# EAGLE schematic SB (EAGLE 8.6.0)
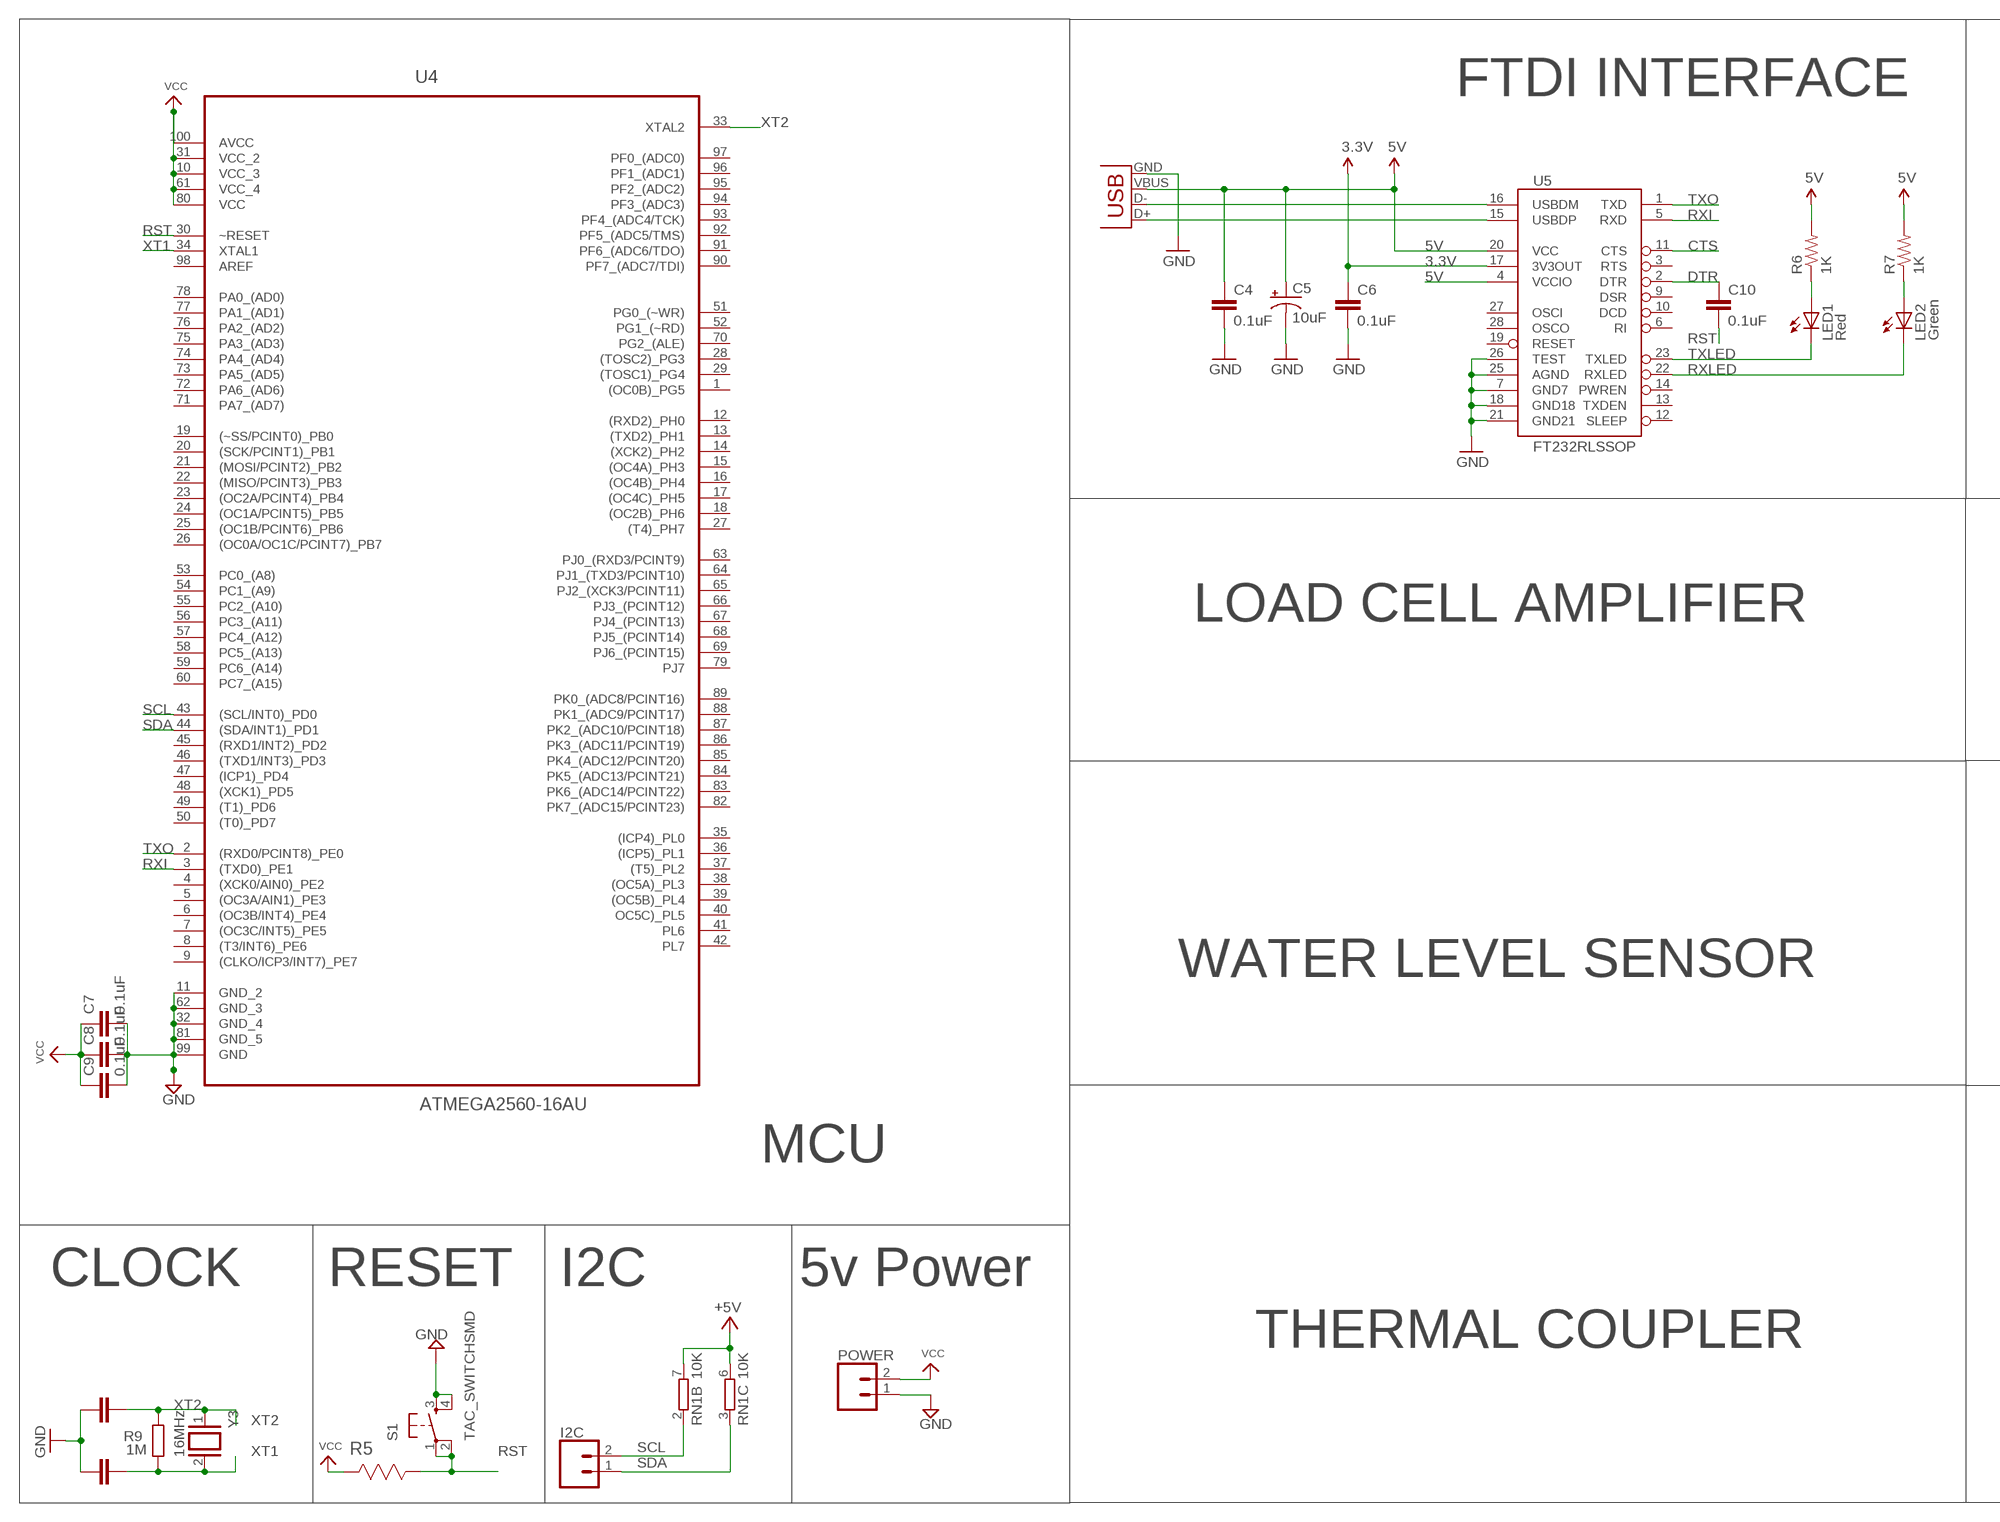
[diagram p0: schematic, sheet 1, part 1 of 2]
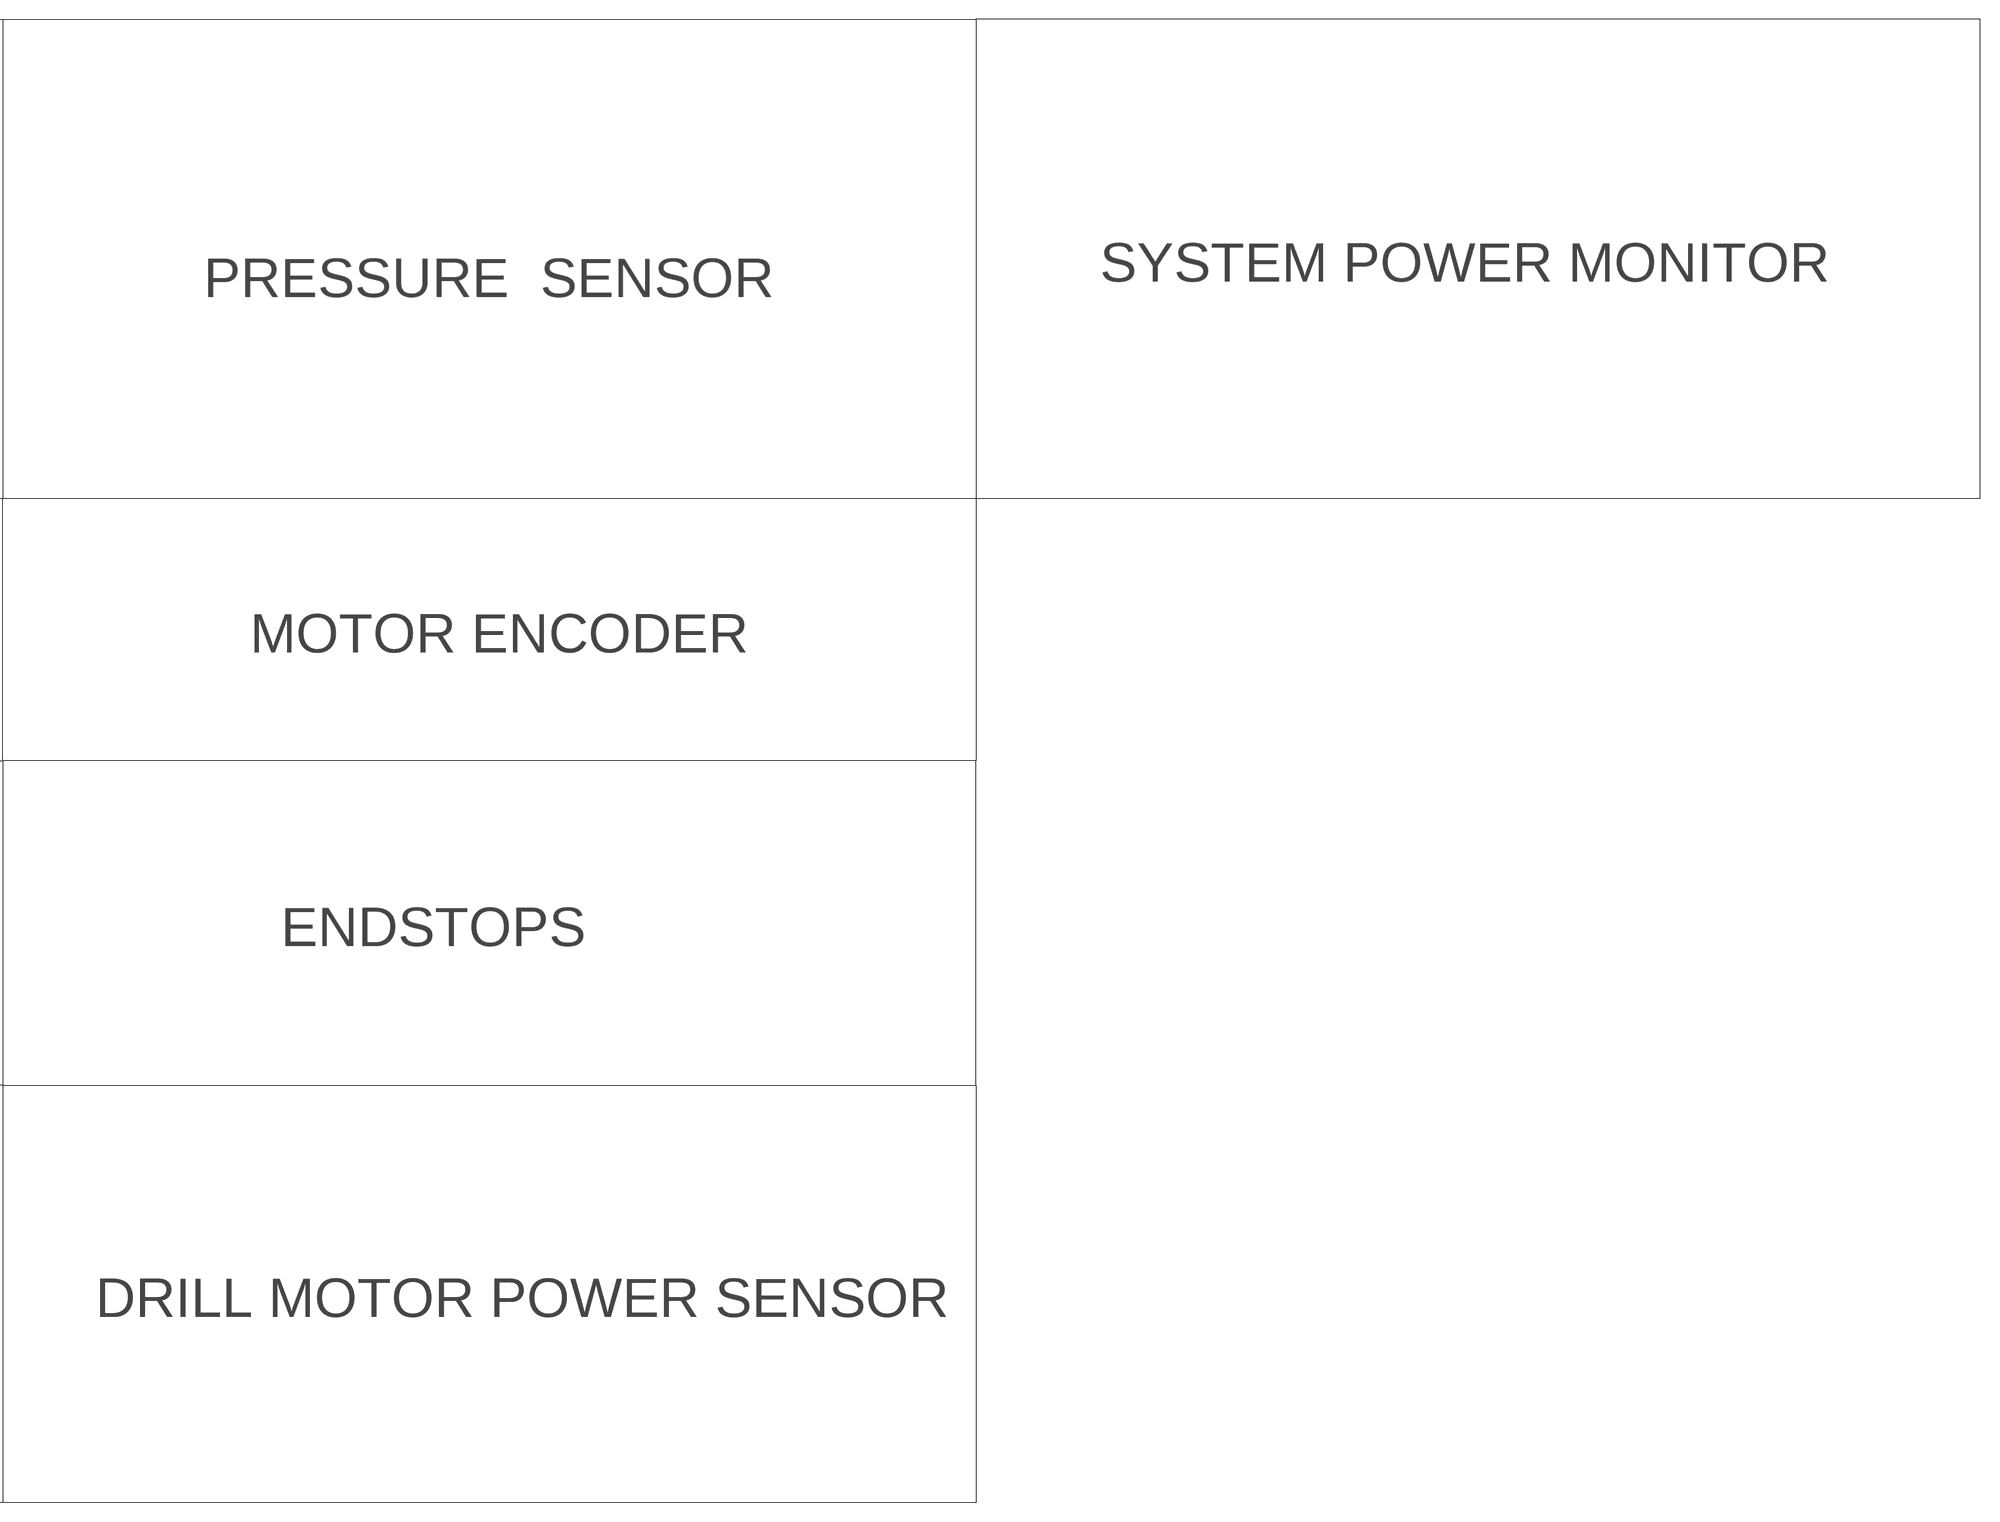
[diagram p1: schematic, sheet 1, part 2 of 2]

## Parts
C4  0.1uF  CAP0402-CAP  [0402-CAP]
C5  10uF  CAP_POL1206  [EIA3216]
C6  0.1uF  CAP0402-CAP  [0402-CAP]
C7  0.1uF  0.1UF-0603-25V-(+80/-20%)  [0603]
C8  0.1uF  0.1UF-0603-25V-(+80/-20%)  [0603]
C9  0.1uF  0.1UF-0603-25V-(+80/-20%)  [0603]
C10  0.1uF  0.1UF-0603-25V-(+80/-20%)  [0603]
C23  22p  C-EU0603-RND  [C0603-ROUND]
C24  22p  C-EU0603-RND  [C0603-ROUND]
I2C  CONN_023.5MM_LOCK  [SCREWTERMINAL-3.5MM-2_LOCK]
LED1  Red  LED0603  [LED-0603]
LED2  Green  LED0603  [LED-0603]
POWER  CONN_023.5MM_LOCK  [SCREWTERMINAL-3.5MM-2_LOCK]
R5  CRM0805-FW-R050ELF  [RESC2013X65N]
R6  1K  RESISTOR0402-RES  [0402-RES]
R7  1K  RESISTOR0402-RES  [0402-RES]
R9  1M  R-EU_R0603  [R0603-ROUND]
RN1  10K  4R-NCAT16  [CAT16]
S1  TAC_SWITCHSMD  [TACTILE-SWITCH-SMD]
U4  ATMEGA2560-16AU  [QFP50P1600X1600X120-100N]
U5  FT232RLSSOP  [SSOP28DB]
X2  USB-SMD-NS  [USB-MINIB-NOSTOP]
Y3  16MHz  XTAL/S  [QS]

## Nets
3.3V [power]: C6.1 U5.17(3V3OUT)
5V: C4.1 C5.A(+) R6.2 R7.2 U5.4(VCCIO) U5.20(VCC) X2.VBUS
CTS: U5.11(CTS)
DTR: C10.1 U5.2(DTR)
GND: C4.2 C5.C(-) C6.2 C7.2 C8.2 C9.2 C23.2 C24.2 POWER.1 S1.3 S1.4 U4.11(GND_2) U4.32(GND_4) U4.62(GND_3) U4.81(GND_5) U4.99(GND) U5.7(GND7) U5.18(GND18) U5.21(GND21) U5.25(AGND) U5.26(TEST) X2.GND
N$9: LED1.A R6.1
N$10: LED2.A R7.1
RST: C10.2 R5.1(R1) S1.1 S1.2 U4.30(~RESET)
RXI: U4.3((TXD0)_PE1) U5.5(RXD)
RXLED: LED2.C U5.22(RXLED)
SCL: I2C.2 RN1.2 U4.43((SCL/INT0)_PD0)
SDA: I2C.1 RN1.3 U4.44((SDA/INT1)_PD1)
TXLED: LED1.C U5.23(TXLED)
TXO: U4.2((RXD0/PCINT8)_PE0) U5.1(TXD)
USB_D+: U5.15(USBDP) X2.D+
USB_D-: U5.16(USBDM) X2.D-
VCC: C7.1 C8.1 C9.1 POWER.2 R5.2(R2) RN1.6 RN1.7 U4.10(VCC_3) U4.31(VCC_2) U4.61(VCC_4) U4.80(VCC) U4.100(AVCC) ; supply symbol labelled +5V
XT1: C23.1 R9.1 U4.34(XTAL1) Y3.2
XT2: C24.1 R9.2 U4.33(XTAL2) Y3.1
Unconnected: RN1.1 RN1.4 RN1.5 RN1.8 U4.1((OC0B)_PG5) U4.4((XCK0/AIN0)_PE2) U4.5((OC3A/AIN1)_PE3) U4.6((OC3B/INT4)_PE4) U4.7((OC3C/INT5)_PE5) U4.8((T3/INT6)_PE6) U4.9((CLKO/ICP3/INT7)_PE7) U4.12((RXD2)_PH0) U4.13((TXD2)_PH1) U4.14((XCK2)_PH2) U4.15((OC4A)_PH3) U4.16((OC4B)_PH4) U4.17((OC4C)_PH5) U4.18((OC2B)_PH6) U4.19((~SS/PCINT0)_PB0) U4.20((SCK/PCINT1)_PB1) U4.21((MOSI/PCINT2)_PB2) U4.22((MISO/PCINT3)_PB3) U4.23((OC2A/PCINT4)_PB4) U4.24((OC1A/PCINT5)_PB5) U4.25((OC1B/PCINT6)_PB6) U4.26((OC0A/OC1C/PCINT7)_PB7) U4.27((T4)_PH7) U4.28((TOSC2)_PG3) U4.29((TOSC1)_PG4) U4.35((ICP4)_PL0) U4.36((ICP5)_PL1) U4.37((T5)_PL2) U4.38((OC5A)_PL3) U4.39((OC5B)_PL4) U4.40(OC5C)_PL5) U4.41(PL6) U4.42(PL7) U4.45((RXD1/INT2)_PD2) U4.46((TXD1/INT3)_PD3) U4.47((ICP1)_PD4) U4.48((XCK1)_PD5) U4.49((T1)_PD6) U4.50((T0)_PD7) U4.51(PG0_(~WR)) U4.52(PG1_(~RD)) U4.53(PC0_(A8)) U4.54(PC1_(A9)) U4.55(PC2_(A10)) U4.56(PC3_(A11)) U4.57(PC4_(A12)) U4.58(PC5_(A13)) U4.59(PC6_(A14)) U4.60(PC7_(A15)) U4.63(PJ0_(RXD3/PCINT9)) U4.64(PJ1_(TXD3/PCINT10)) U4.65(PJ2_(XCK3/PCINT11)) U4.66(PJ3_(PCINT12)) U4.67(PJ4_(PCINT13)) U4.68(PJ5_(PCINT14)) U4.69(PJ6_(PCINT15)) U4.70(PG2_(ALE)) U4.71(PA7_(AD7)) U4.72(PA6_(AD6)) U4.73(PA5_(AD5)) U4.74(PA4_(AD4)) U4.75(PA3_(AD3)) U4.76(PA2_(AD2)) U4.77(PA1_(AD1)) U4.78(PA0_(AD0)) U4.79(PJ7) U4.82(PK7_(ADC15/PCINT23)) U4.83(PK6_(ADC14/PCINT22)) U4.84(PK5_(ADC13/PCINT21)) U4.85(PK4_(ADC12/PCINT20)) U4.86(PK3_(ADC11/PCINT19)) U4.87(PK2_(ADC10/PCINT18)) U4.88(PK1_(ADC9/PCINT17)) U4.89(PK0_(ADC8/PCINT16)) U4.90(PF7_(ADC7/TDI)) U4.91(PF6_(ADC6/TDO)) U4.92(PF5_(ADC5/TMS)) U4.93(PF4_(ADC4/TCK)) U4.94(PF3_(ADC3)) U4.95(PF2_(ADC2)) U4.96(PF1_(ADC1)) U4.97(PF0_(ADC0)) U4.98(AREF) U5.3(RTS) U5.6(RI) U5.9(DSR) U5.10(DCD) U5.12(SLEEP) U5.13(TXDEN) U5.14(PWREN) U5.19(RESET) U5.27(OSCI) U5.28(OSCO)

## Notes on the sheet
- FTDI INTERFACE
- PRESSURE  SENSOR | SYSTEM POWER MONITOR
- LOAD CELL AMPLIFIER
- MOTOR ENCODER
- ENDSTOPS
- WATER LEVEL SENSOR
- MCU
- CLOCK | RESET | I2C | 5v Power
- DRILL MOTOR POWER SENSOR
- THERMAL COUPLER

## Library data of the parts
C4 C6 = SparkFun:CAP: Capacitor Standard 0603 ceramic capacitor, and 0.1" leaded capacitor.
C5 = SparkFun:CAP_POL: Capacitor Polarized These are standard SMD and PTH capacitors. Normally 10uF, 47uF, and 100uF in electrolytic and tantalum varieties. Always verify the external diameter of the through hole cap, it varies with capacity, voltage, and manufacturer. The EIA devices should be standard.
C7-C10 = SparkFun-Capacitors:0.1UF: 0.1µF ceramic capacitors A capacitor is a passive two-terminal electrical component used to store electrical energy temporarily in an electric field.; PROD_ID: CAP-00810
C23 C24 = SmartPrj:C-EU: CAPACITOR, European symbol
I2C POWER = SparkFun-Retired:CONN_02: Multi connection point. Often used as Generic Header-pin footprint for 0.1 inch spaced/style header connections On any of the 0.1 inch spaced packages, you can populate with these: Break Away Headers - Straight <https://www.sparkfun.com/products/116> (PRT-00116) Break Away Male Headers - Right Angle <https://www.sparkfun.com/products/553> (PRT-00553) Female Headers <https://www.sparkfun.com/products/115> (PRT-00115) Break Away Headers - Machine Pin <https://www.sparkfun.com/products/117> (PRT-00117) Break Away Female Headers - Swiss Machine Pin <https://www.sparkfun.com/products/743> (PRT-00743) For SCREWTERMINALS and SPRING TERMINALS visit here: Screw Terimnals on SparkFun.com <https://www.sparkfun.com/search/results?term=Screw+Terminals> (5mm/3.5mm/2.54mm spacing) This device is also useful as a general connection point to wire up your design to another part of your project. Our various solder wires solder well into these plated through hole pads. Hook-Up Wire - Assortment (Stranded, 22 AWG) <https://www.sparkfun.com/products/11375> (PRT-11375) Hook-Up Wire - Assortment (Solid Core, 22 AWG) <https://www.sparkfun.com/products/11367> (PRT-11367) View the entire wire category on our website here <https://www.sparkfun.com/categories/141> Special notes: Molex polarized connector foot print use with: PRT-08233 with associated crimp pins and housings. 2.54_SCREWTERM for use with PRT-10571. 3.5mm Screw Terminal footprints for PRT-08084 5mm Screw Terminal footprints for use with PRT-08432; PROD_ID: CONN-08399
LED1 LED2 = SparkFun:LED: LEDs Standard schematic elements and footprints for 5mm, 3mm, 1206, and 0603 sized LEDs. 5mm - Spark Fun Electronics SKU : COM-00529 (and others)
R5 = Bourns_By_element14_Batch_1:CRM0805-FW-R050ELF: Resistor 0805; MPN: CRM0805-FW-R050ELF; OC_FARNELL: 1865234; OC_NEWARK: 17T4231; SUPPLIER: BOURNS; TOLERANCE: ±1 %; VALUE: 0.05 Ohm; WATTAGE: 0.25 W
R6 R7 = SparkFun:RESISTOR: Resistor Basic schematic elements and footprints for 0603, 1206, and PTH 1/10th watt (small) resistors.
R9 = SmartPrj:R-EU_: RESISTOR, European symbol
RN1 = resistor-dil:4R-N: Array Chip Resistor Source: RS Component / Phycomp
S1 = SparkFun-Retired:TAC_SWITCH: Momentary Switch Button commonly used for reset or general input. Spark Fun Electronics SKU : COM-00097 SMT- SWCH-08247; PROD_ID: SWCH-08247
U4 = Atmel_By_element14_Batch_1-00:ATMEGA2560-16AU: Microcontroller; DESCRIPTION: Microcontroller; MPN: ATMEGA2560-16AU; OC_FARNELL: 1288330; OC_NEWARK: 23M5051; PACKAGE: LQFP-100; SUPPLIER: ATMEL
U5 = SparkFun:FT232RL: USB UART FT232RL 4th Generation USB UART (USB <-> Serial) Controller. Spark Fun Electronics SKU : COM-00650
X2 = SparkFun:USB: USB Connectors USB-B-PTH is fully proven SKU : PRT-00139 USB-miniB is fully proven SKU : PRT-00587 USB-A-PCB is untested. USB-A-H is throughly reviewed, but untested. Spark Fun Electronics SKU : PRT-00437 USB-B-SMT is throughly reviewed, but untested. Needs silkscreen touching up. USB-A-S has not been used/tested USB-MB-H has not been used/tested
Y3 = SmartPrj:XTAL/S: CRYSTAL

## Net classes
1 power: width 0.254 mm
3 power usb: width 0.508 mm, drill 0.406 mm, clearance 0.203 mm